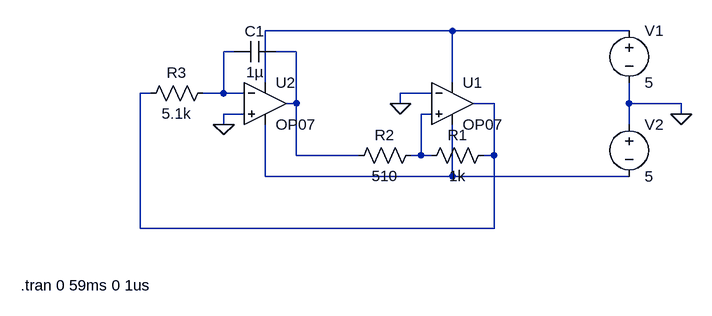
[diagram p0: schematic snesors en versterkers oscillator.asc]
snesors en versterkers oscillator.asc, the LTspice schematic file:
Version 4
SHEET 1 880 680
WIRE 176 32 -112 32
WIRE 448 32 176 32
WIRE -160 64 -176 64
WIRE -64 64 -96 64
WIRE -112 112 -112 32
WIRE 176 112 176 32
WIRE -288 128 -304 128
WIRE -176 128 -176 64
WIRE -176 128 -208 128
WIRE -144 128 -176 128
WIRE 144 128 96 128
WIRE -64 144 -64 64
WIRE -64 144 -80 144
WIRE 96 144 96 128
WIRE 240 144 208 144
WIRE 448 144 448 112
WIRE 528 144 448 144
WIRE -144 160 -176 160
WIRE 144 160 128 160
WIRE 528 160 528 144
WIRE -176 176 -176 160
WIRE 448 176 448 144
WIRE -64 224 -64 144
WIRE 32 224 -64 224
WIRE 128 224 128 160
WIRE 128 224 112 224
WIRE 144 224 128 224
WIRE 240 224 240 144
WIRE 240 224 224 224
WIRE -112 256 -112 176
WIRE 176 256 176 176
WIRE 176 256 -112 256
WIRE 448 256 176 256
WIRE -304 336 -304 128
WIRE 240 336 240 224
WIRE 240 336 -304 336
FLAG 528 160 0
FLAG 96 144 0
FLAG -176 176 0
SYMBOL OpAmps\\OP07 176 80 R0
SYMATTR InstName U1
SYMBOL voltage 448 16 R0
WINDOW 123 0 0 Left 0
WINDOW 39 0 0 Left 0
SYMATTR InstName V1
SYMATTR Value 5
SYMBOL voltage 448 160 R0
WINDOW 123 0 0 Left 0
WINDOW 39 0 0 Left 0
SYMATTR InstName V2
SYMATTR Value 5
SYMBOL res 240 208 R90
WINDOW 0 0 56 VBottom 2
WINDOW 3 32 56 VTop 2
SYMATTR InstName R1
SYMATTR Value 1k
SYMBOL res 128 208 R90
WINDOW 0 0 56 VBottom 2
WINDOW 3 32 56 VTop 2
SYMATTR InstName R2
SYMATTR Value 510
SYMBOL OpAmps\\OP07 -112 80 R0
SYMATTR InstName U2
SYMBOL cap -96 48 R90
WINDOW 0 0 32 VBottom 2
WINDOW 3 32 32 VTop 2
SYMATTR InstName C1
SYMATTR Value 1µ
SYMBOL res -192 112 R90
WINDOW 0 0 56 VBottom 2
WINDOW 3 32 56 VTop 2
SYMATTR InstName R3
SYMATTR Value 5.1k
TEXT -488 424 Left 2 !.tran 0 59ms 0 1us

The netlist it stands for:
* snesors en versterkers oscillator.asc
XU1 N005 0 N001 N006 N004 LT1001  ; OP07, pins In+ In- V+ V- OUT
V1 N001 0 5
V2 0 N006 5
R1 N004 N005 1k
R2 N005 N003 510
XU2 0 N002 N001 N006 N003 LT1001  ; OP07, pins In+ In- V+ V- OUT
C1 N003 N002 1µ
R3 N002 N004 5.1k
.tran 0 59ms 0 1us
.lib LTC.lib
.backanno
.end